# Altium schematic sheet Sheet.SchDoc
size A3
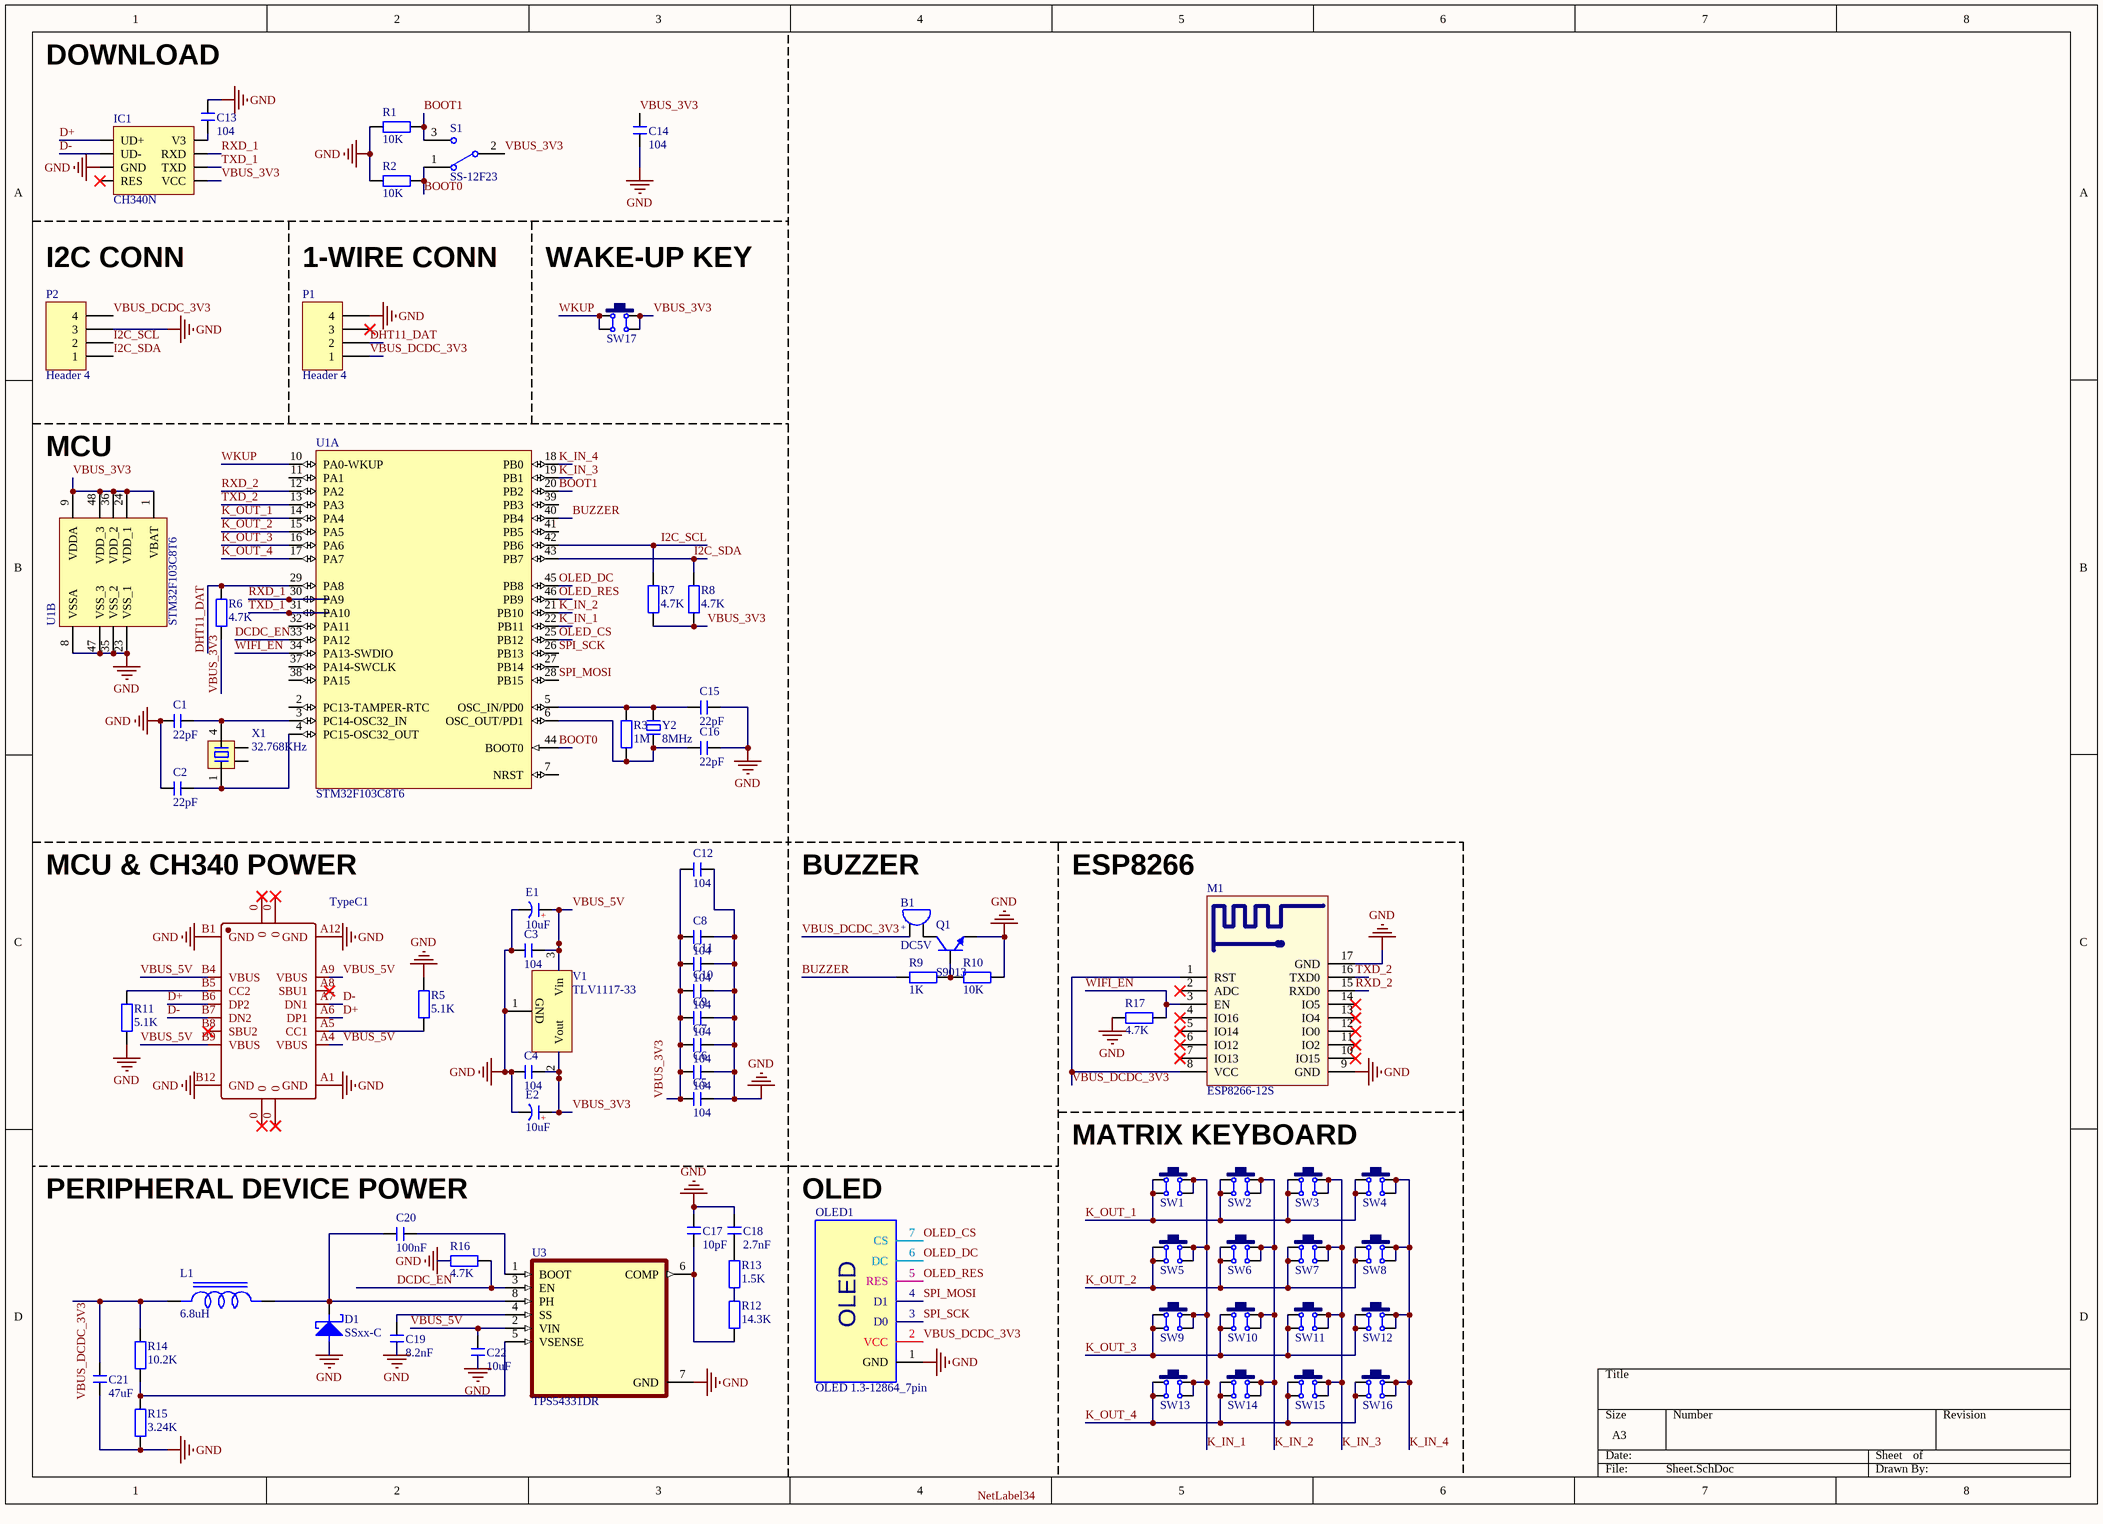
[diagram p0: Sheet.SchDoc]

## Parts
B1  DC5V  [BEEP 5x9x5.5]
C1  22pF  [C 0805]
C2  22pF  [C 0805]
C3  104  [C 0805]
C4  104  [C 0805]
C5  104  [C 0805]
C6  104  [C 0805]
C7  104  [C 0805]
C8  104  [C 0805]
C9  104  [C 0805]
C10  104  [C 0805]
C11  104  [C 0805]
C12  104  [C 0805]
C13  104  [C 0805]
C14  104  [C 0805]
C15  22pF  [C 0805]
C16  22pF  [C 0805]
C17  10pF  [C 0805]
C18  2.7nF  [C 0805]
C19  8.2nF  [C 0805]
C20  100nF  [C 0805]
C21  47uF  [C 0805]
C22  10uF  [C 0805]
D1  SSxx-C  [SMA]
E1  10uF  [CD A(3216)]
E2  10uF  [CD A(3216)]
IC1  CH340N  [SOP8_N]
L1  6.8uH  [IND_SRR4818A-6R8Y]
M1  ESP8266-12S  [ESP-12S Module]
OLED1  OLED 1.3-12864_7pin  [OLED 1.3-12864_7pin]
P1  Header 4  [HDR1X4]
P2  Header 4  [HDR1X4]
Q1  S9013  [SOT23-3N]
R1  10K  [R 0805]
R2  10K  [R 0805]
R3  1M  [R 0805]
R5  5.1K  [R 0805]
R6  4.7K  [R 0805]
R7  4.7K  [R 0805]
R8  4.7K  [R 0805]
R9  1K  [R 0805]
R10  10K  [R 0805]
R11  5.1K  [R 0805]
R12  14.3K  [R 0805]
R13  1.5K  [R 0805]
R14  10.2K  [R 0805]
R15  3.24K  [R 0805]
R16  4.7K  [R 0805]
R17  4.7K  [R 0805]
S1  SS-12F23  [MSK-12C01-07]
SW1  6x6x5  [TSW SMD-6*6*4.3]  (value not drawn)
SW2  6x6x5  [TSW SMD-6*6*4.3]  (value not drawn)
SW3  6x6x5  [TSW SMD-6*6*4.3]  (value not drawn)
SW4  6x6x5  [TSW SMD-6*6*4.3]  (value not drawn)
SW5  6x6x5  [TSW SMD-6*6*4.3]  (value not drawn)
SW6  6x6x5  [TSW SMD-6*6*4.3]  (value not drawn)
SW7  6x6x5  [TSW SMD-6*6*4.3]  (value not drawn)
SW8  6x6x5  [TSW SMD-6*6*4.3]  (value not drawn)
SW9  6x6x5  [TSW SMD-6*6*4.3]  (value not drawn)
SW10  6x6x5  [TSW SMD-6*6*4.3]  (value not drawn)
SW11  6x6x5  [TSW SMD-6*6*4.3]  (value not drawn)
SW12  6x6x5  [TSW SMD-6*6*4.3]  (value not drawn)
SW13  6x6x5  [TSW SMD-6*6*4.3]  (value not drawn)
SW14  6x6x5  [TSW SMD-6*6*4.3]  (value not drawn)
SW15  6x6x5  [TSW SMD-6*6*4.3]  (value not drawn)
SW16  6x6x5  [TSW SMD-6*6*4.3]  (value not drawn)
SW17  6x6x5  [TSW SMD-6*6*4.3]  (value not drawn)
TypeC1  TypeC-16pin  [typeC-16pin]  (value not drawn)
U1  STM32F103C8T6  [LQFP48 7X7_N]  (parts A,B of 2)
U3  TPS54331DR  [SOIC127P599X175-8N]
V1  TLV1117-33  [SOT223_L]
X1  32.768KHz  [OSC MC-146]
Y2  8MHz  [OSC HC-49SMD]

## Nets
GND: C1.2 C2.2 C3.2 C4.2 C5.2 C6.2 C7.2 C8.2 C9.2 C10.2 C11.2 C12.2 C13.1 C14.2 C15.1 C16.1 C17.2 C18.2 C19.1 C21.1 C22.1 D1.1(A) E1.2(K) E2.2(K) IC1.3(GND) M1.9(GND) M1.17(GND) OLED1.1(GND) P1.4 P2.3 Q1.2(E) R1.1 R2.1 R5.1 R10.1 R11.1 R15.2 R16.1 R17.2 TypeC1.A1(GND) TypeC1.A12(GND) TypeC1.B1(GND) TypeC1.B12(GND) U1.8(VSSA) U1.23(VSS_1) U1.35(VSS_2) U1.47(VSS_3) U3.7(GND) V1.1(GND)
BOOT0: R2.2 S1.1 U1.44(BOOT0)
BOOT1: R1.2 S1.3 U1.20(PB2)
BUZZER: R9.2 U1.40(PB4)
D+: IC1.1(UD+) TypeC1.A6(DP1) TypeC1.B6(DP2)
D-: IC1.2(UD-) TypeC1.A7(DN1) TypeC1.B7(DN2)
DCDC_EN: R16.2 U1.33(PA12) U3.3(EN)
DHT11_DAT: P1.2 R6.2 U1.29(PA8)
I2C_SCL: P2.2 R7.2 U1.42(PB6)
I2C_SDA: P2.1 R8.2 U1.43(PB7)
K_IN_1: SW1.2 SW1.3 SW5.2 SW5.3 SW9.2 SW9.3 SW13.2 SW13.3 U1.22(PB11)
K_IN_2: SW2.2 SW2.3 SW6.2 SW6.3 SW10.2 SW10.3 SW14.2 SW14.3 U1.21(PB10)
K_IN_3: SW3.2 SW3.3 SW7.2 SW7.3 SW11.2 SW11.3 SW15.2 SW15.3 U1.19(PB1)
K_IN_4: SW4.2 SW4.3 SW8.2 SW8.3 SW12.2 SW12.3 SW16.2 SW16.3 U1.18(PB0)
K_OUT_1: SW1.1 SW1.4 SW2.1 SW2.4 SW3.1 SW3.4 SW4.1 SW4.4 U1.14(PA4)
K_OUT_2: SW5.1 SW5.4 SW6.1 SW6.4 SW7.1 SW7.4 SW8.1 SW8.4 U1.15(PA5)
K_OUT_3: SW9.1 SW9.4 SW10.1 SW10.4 SW11.1 SW11.4 SW12.1 SW12.4 U1.16(PA6)
K_OUT_4: SW13.1 SW13.4 SW14.1 SW14.4 SW15.1 SW15.4 SW16.1 SW16.4 U1.17(PA7)
OLED_CS: OLED1.7(CS) U1.25(PB12)
OLED_DC: OLED1.6(DC) U1.45(PB8)
OLED_RES: OLED1.5(RES) U1.46(PB9)
RXD_1: IC1.7(RXD) U1.30(PA9)
RXD_2: M1.15(RXD0) U1.12(PA2)
SPI_MOSI: OLED1.4(D1) U1.28(PB15)
SPI_SCK: OLED1.3(D0) U1.26(PB13)
TXD_1: IC1.6(TXD) U1.31(PA10)
TXD_2: M1.16(TXD0) U1.13(PA3)
VBUS_3V3: C4.1 C5.1 C6.1 C7.1 C8.1 C9.1 C10.1 C11.1 C12.1 C14.1 E2.1(A) IC1.5(VCC) R6.1 R7.1 R8.1 S1.2 SW17.2 SW17.3 U1.1(VBAT) U1.9(VDDA) U1.24(VDD_1) U1.36(VDD_2) U1.48(VDD_3) V1.2(Vout)
VBUS_5V: C3.1 C22.2 E1.1(A) TypeC1.A4(VBUS) TypeC1.A9(VBUS) TypeC1.B4(VBUS) TypeC1.B9(VBUS) U3.2(VIN) V1.3(Vin)
VBUS_DCDC_3V3: B1.1 C21.2 L1.1 M1.1(RST) M1.8(VCC) OLED1.2(VCC) P1.1 P2.4 R14.1
WIFI_EN: M1.3(EN) R17.1 U1.34(PA13-SWDIO)
WKUP: SW17.1 SW17.4 U1.10(PA0-WKUP)
NetB1_2: B1.2 Q1.3(C)
NetC1_1: C1.1 U1.3(PC14-OSC32_IN) X1.4
NetC2_1: C2.1 U1.4(PC15-OSC32_OUT) X1.1
NetC13_2: C13.2 IC1.8(V3)
NetC15_2: C15.2 R3.2 U1.5(OSC_IN/PD0) Y2.2
NetC16_2: C16.2 R3.1 U1.6(OSC_OUT/PD1) Y2.1
NetC17_1: C17.1 R12.2 U3.6(COMP)
NetC18_1: C18.1 R13.1
NetC19_2: C19.2 U3.4(SS)
NetC20_1: C20.1 D1.2(K) L1.2 U3.8(PH)
NetC20_2: C20.2 U3.1(BOOT)
NetQ1_1: Q1.1(B) R9.1 R10.2
NetR5_2: R5.2 TypeC1.A5(CC1)
NetR11_2: R11.2 TypeC1.B5(CC2)
NetR12_1: R12.1 R13.2
NetR14_2: R14.2 R15.1 U3.5(VSENSE)

Not connected (* = marked no-connect by the designer): IC1 4(RES)*; M1 2(ADC)* 4(IO16)* 5(IO14)* 6(IO12)* 7(IO13)* 10(IO15)* 11(IO2)* 12(IO0)* 13(IO4)* 14(IO5)*; P1 3*; TypeC1 0* A8(SBU1)* B8(SBU2)*; U1 2(PC13-TAMPER-RTC) 7(NRST) 11(PA1) 27(PB14) 32(PA11) 37(PA14-SWCLK) 38(PA15) 39(PB3) 41(PB5); X1 2 3

## Notes on the sheet
- DOWNLOAD
- I2C CONN
- 1-WIRE CONN
- (near SW17) WAKE-UP KEY
- MCU
- MCU & CH340 POWER
- BUZZER
- ESP8266
- MATRIX KEYBOARD
- (near C20) PERIPHERAL DEVICE POWER
- OLED
- Labels drawn without touching a wire or pin: NetLabel34
- (in symbol BEEP) +
- (in symbol C-CD) +
- (in symbol OLED-1.3-SPI) OLED

## Library data of the parts
B1 = BEEP: 蜂鸣器; 版权归属: 黎明电子style; BOM名称: 蜂鸣器; 学习资源: https://lmdzstyle.taobao.com/
C1-C22 = C: 无极性贴片电容; 版权归属: 黎明电子style; BOM名称: 无极性贴片电容; 学习资源: https://lmdzstyle.taobao.com/
D1 = SSxx-C: 肖特基二极管-贴片; BOM名称: 肖特基二极管
E1 E2 = C-CD: 贴片钽电容; 版权归属: 黎明电子style; BOM名称: 贴片钽电容; 学习资源: https://lmdzstyle.taobao.com/
IC1 = CH340N: 串口转USB; 版权归属: 黎明电子style; BOM名称: 串口转USB; 学习资源: https://lmdzstyle.taobao.com/
L1 = SRR4818A-6R8Y: Package: None; Price: None; Value: *; MP: SRR4818A-6R8Y; Availability: Unavailable
M1 = ESP8266-12S: 串口WIFI模块，ESP8266-12S
OLED1 = OLED-1.3-SPI: OLED-SPI; BOM名称: 12864 点阵屏
P1 P2 = Header 4: Header, 4-Pin; LatestRevisionDate: 17-Jul-2002; LatestRevisionNote: Re-released for DXP Platform.; Publisher: Altium Limited
Q1 = 9013-SMD: 低频放大-NPN型; 版权归属: 源创客; 属性: 50V?0.5A?0.625W; BOM名称: 低频放大-NPN型; 学习资源: www.ooocke.com
R1-R3 R5-R17 = R: 贴片电阻; 版权归属: 黎明电子style; BOM名称: 贴片电阻; 学习资源: https://lmdzstyle.taobao.com/
S1 = SSW-1P: 1路波动开关; BOM名称: 波动开关; 版权归属: 黎明电子style; 学习资源: https://lmdzstyle.taobao.com/
SW1-SW17 = TSW SMD-6x6: 贴片6x6轻触开关; 版权归属: 黎明电子style; BOM名称: 贴片6x6轻触开关; 学习资源: https://lmdzstyle.taobao.com/
TypeC1 = TypeC-16pin: USB-C-16Pin
U1 = STM32F103C8Tx: Pin:48/IO:36; BOM名称: 32位STM单片机; 版权归属: 校基地硬件部; Flash: 64kBytes; RAM: 20kBytes; Freq: 72MHz; IO: 36; Package: LQFP48(7x7mm)
U3 = TPS54331DR: 3.5V to 28V Input, 3A, 570kHz Step-Down Converter with Eco-mode 8-SOIC -40 to 150; MF: Texas Instruments; Value: *; SnapEDA_Link: https://www.snapeda.com/parts/TPS54331DR/Texas%20Instruments/view-part/1101419/?ref=snap; Texas_Instruments-Purchase-URL: https://snapeda.com/shop?store=Texas+Instruments&id=1101419; Mouser-Purchase-URL: https://snapeda.com/shop?store=Mouser&id=1101419; Availability: Unavailable; Price: None; Package: SOIC-8 Texas Instruments; DigiKey-Purchase-URL: https://snapeda.com/shop?store=DigiKey&id=1101419; MP: TPS54331DR
V1 = AMS1117: 三端稳压芯片; BOM名称: 稳压芯片; 版权归属: 源创客; 学习资源: www.ooocke.com
X1 = XTAL-MC-4P: MC系列4脚晶振; BOM名称: 2脚无源脚晶振; 版权归属: 源创客; 学习资源: www.ooocke.com
Y2 = XTAL-2P: 2脚无源脚晶振; 版权归属: 源创客; BOM名称: 2脚无源脚晶振; 学习资源: www.ooocke.com